# Altium project zs-pentagon-dip.PrjPCB
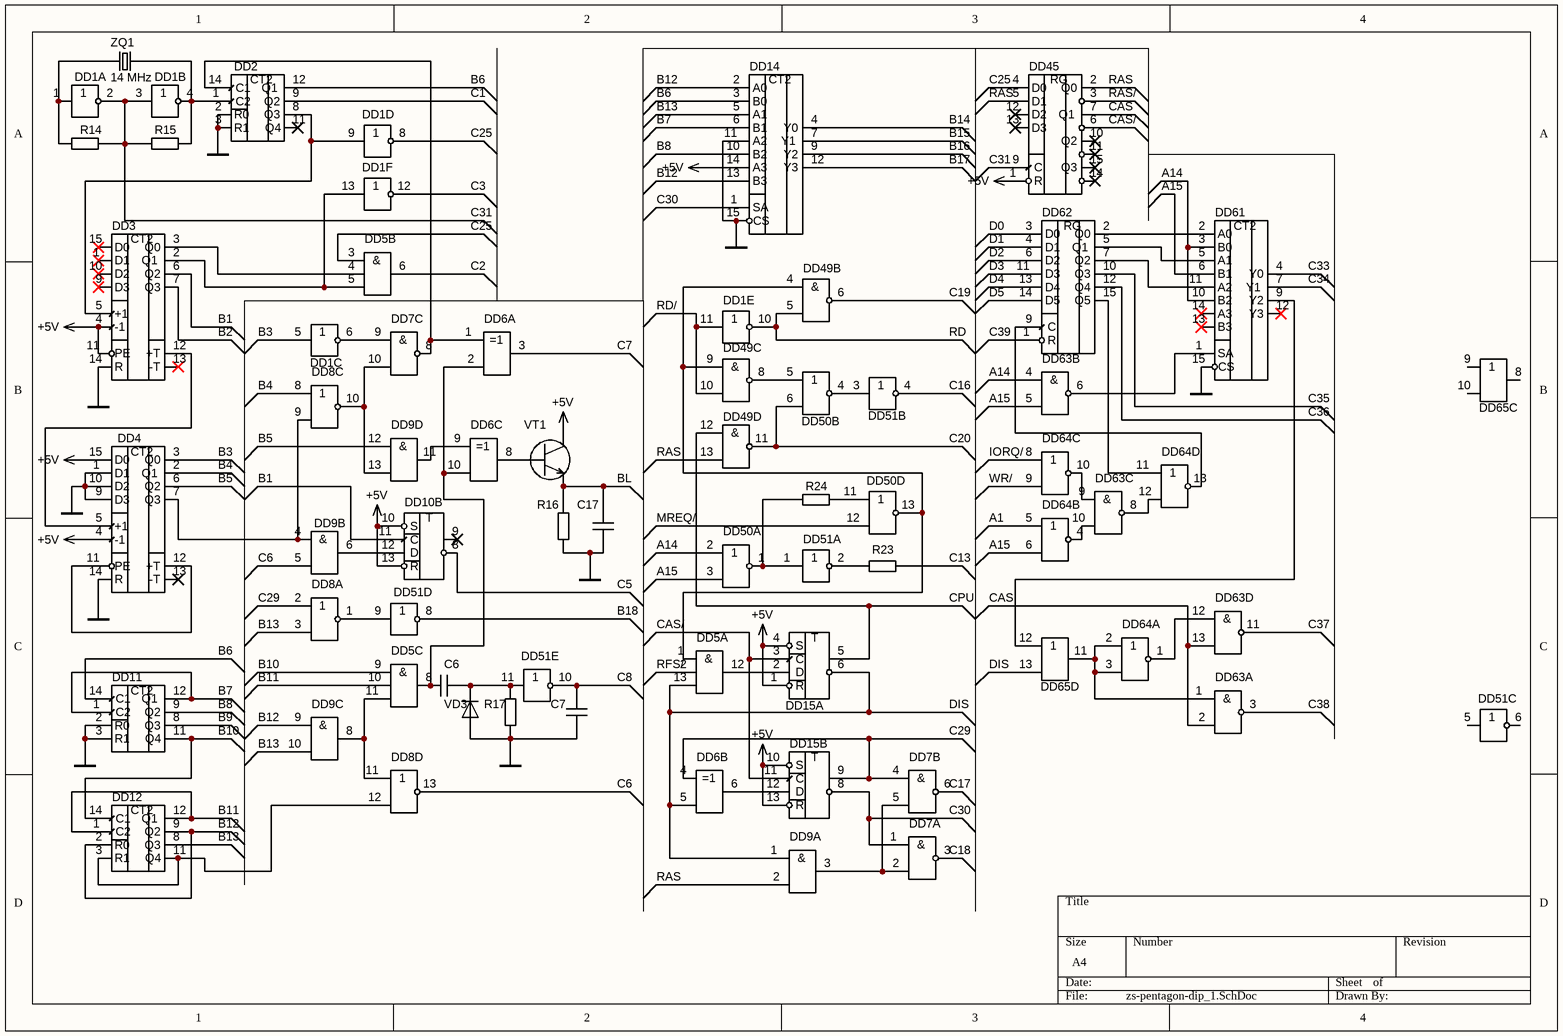
[diagram p0: zs-pentagon-dip_1.SchDoc]
5 sheets, 182 parts. Net scope: global (net labels, ports and power ports of the same name join across sheets).
Board file: zs-pentagon-dip.PcbDoc
Sheets:
  zs-pentagon-dip_1.SchDoc
  zs-pentagon-dip_2.SchDoc
  zs-pentagon-dip_3.SchDoc
  zs-pentagon-dip_4.SchDoc
  zs-pentagon-dip_5.SchDoc

## Sheet zs-pentagon-dip_1.SchDoc
size A4

### Parts
C6  0.022 мкФ  [C0805]  (value not drawn)
C7  510 пФ  [C0805]  (value not drawn)
C17  1200 пФ  [C0805]  (value not drawn)
DD1  КР1533ЛН1  [DIP14]  (value not drawn)  (parts A,B,C,D,E,F of 6)
DD2  КР1533ИЕ5  [DIP14]  (value not drawn)
DD3  КР1533ИЕ7  [DIP16]  (value not drawn)
DD4  КР1533ИЕ7  [DIP16]  (value not drawn)
DD5  КР1533ЛИ3  [DIP14]  (value not drawn)  (parts A,B,C of 3)
DD6  КР1533ЛП5  [DIP14]  (value not drawn)  (parts A,B,C of 4)
DD7  КР1533ЛA3  [DIP14]  (value not drawn)  (parts A,B,C of 4)
DD8  КР1533ЛЕ1  [DIP14]  (value not drawn)  (parts A,C,D of 4)
DD9  КР1533ЛИ1  [DIP14]  (value not drawn)  (parts A,B,C,D of 4)
DD10  КР1533ТМ2  [DIP14]  (value not drawn)  (part B of 2)
DD11  КР1533ИЕ5  [DIP14]  (value not drawn)
DD12  КР1533ИЕ5  [DIP14]  (value not drawn)
DD14  КР1533КП11А  [DIP16]  (value not drawn)
DD15  КР1533ТМ2  [DIP14]  (value not drawn)  (parts A,B of 2)
DD45  КР1533ТМ8  [DIP16]  (value not drawn)
DD49  КР1533ЛA3  [DIP14]  (value not drawn)  (parts B,C,D of 4)
DD50  КР1533ЛЕ1  [DIP14]  (value not drawn)  (parts A,B,D of 4)
DD51  КР1533ЛН1  [DIP14]  (value not drawn)  (parts A,B,C,D,E of 6)
DD61  КР1533КП11А  [DIP16]  (value not drawn)
DD62  КР1533ТМ9  [DIP16]  (value not drawn)
DD63  КР1533ЛA3  [DIP14]  (value not drawn)  (parts A,B,C,D of 4)
DD64  КР1533ЛЕ1  [DIP14]  (value not drawn)  (parts A,B,C,D of 4)
DD65  КР1533ЛЛ1  [DIP14]  (value not drawn)  (parts C,D of 4)
R14  510 Ом  [R0603]  (value not drawn)
R15  510 Ом  [R0603]  (value not drawn)
R16  160 Ом  [R0603]  (value not drawn)
R17  1 кОм  [R0603]  (value not drawn)
R23  470 Ом  [R0603]  (value not drawn)
R24  470 Ом  [R0603]  (value not drawn)
VD3  1N4148W  [SODFL1608X70N]  (value not drawn)
VT1  КТ315Б  [KT-13]  (value not drawn)
ZQ1  14 MHz  [XTAL_HC-49U]

### Nets
GND: C7.2 C17.1 DD1.7(GND) DD2.2(R0) DD2.3(R1) DD2.10(GND) DD3.8(GND) DD3.14(R) DD4.1(D1) DD4.8(GND) DD4.9(D3) DD4.10(D2) DD4.14(R) DD5.7(GND) DD6.7(GND) DD7.7(GND) DD8.7(GND) DD9.7(GND) DD11.2(R0) DD11.3(R1) DD11.10(GND) DD12.10(GND) DD14.8(GND) DD14.11(A2) DD14.15(CS) DD15.7(GND) DD45.8(GND) DD50.7(GND) DD51.7(GND) DD61.8(GND) DD61.15(CS) DD62.8(GND) DD63.7(GND) DD64.7(GND) R16.1 R17.1 VD3.A
VCC: DD1.14(VCC) DD2.5(VCC) DD3.4(-1) DD3.11(PE) DD3.16(VCC) DD4.4(-1) DD4.15(D0) DD4.16(VCC) DD5.14(VCC) DD6.14(VCC) DD7.14(VCC) DD8.14(VCC) DD9.14(VCC) DD10.10(S) DD10.13(R) DD11.5(VCC) DD12.5(VCC) DD14.14(A3) DD14.16(VCC) DD15.1(R) DD15.4(S) DD15.10(S) DD15.13(R) DD15.14(VCC) DD45.1(R) DD45.16(VCC) DD50.14(VCC) DD51.14(VCC) DD61.16(VCC) DD62.16(VCC) DD63.14(VCC) DD64.14(VCC) VT1.2(C)  [also labelled +5V]
A1: DD64.5
A14: DD50.2 DD61.3(B0) DD61.10(B2) DD63.4
A15: DD50.3 DD61.6(B1) DD63.5 DD64.6
B1: DD3.6(Q2) DD10.11(C)
B2: DD3.7(Q3)
B3: DD1.5 DD4.3(Q0)
B4: DD4.2(Q1) DD8.8
B5: DD4.6(Q2) DD9.12
B6: DD2.12(Q1) DD11.14(C1) DD14.3(B0)
B7: DD11.1(C2) DD11.12(Q1) DD14.6(B1)
B8: DD11.9(Q2) DD14.10(B2)
B9: DD11.8(Q3)
B10: DD5.9 DD11.11(Q4) DD12.14(C1)
B11: DD5.10 DD12.1(C2) DD12.12(Q1)
B12: DD9.9 DD12.2(R0) DD12.9(Q2) DD14.2(A0) DD14.13(B3)
B13: DD8.3 DD9.10 DD12.8(Q3) DD14.5(A1)
B14: DD14.4(Y0)
B15: DD14.7(Y1)
B16: DD14.9(Y2)
B17: DD14.12(Y3)
B18: DD51.8
BL: C17.2 R16.2 VT1.1(E)
C1: DD2.9(Q2)
C2: DD5.6
C3: DD1.12
C5: DD10.8
C6: DD8.13 DD9.5
C7: DD6.3
C8: C7.1 DD51.10
C13: R23.1
C16: DD51.4
C17: DD7.6
C18: DD7.3
C19: DD49.6
C20: DD49.11 DD50.6
C25: DD1.8 DD5.3 DD45.4(D0)
C29: DD6.4 DD7.4 DD8.2 DD15.9
C30: DD7.1 DD14.1(SA) DD15.8
C31: DD1.2 DD1.3 DD45.9(C) R14.2 R15.1
C33: DD61.4(Y0)
C34: DD61.7(Y1)
C35: DD62.10(Q3)
C36: DD62.12(Q4)
C37: DD63.11
C38: DD63.3
C39: DD62.1(R)
CAS: DD45.7(Q1) DD63.2 DD63.13
CAS/: DD15.3(C) DD15.11(C) DD45.6
CPU: DD15.5 DD49.12
D0: DD62.3(D0)
D1: DD62.4(D1)
D2: DD62.6(D2)
D3: DD62.11(D3)
D4: DD62.13(D4)
D5: DD62.14(D5)
DIS: DD5.13 DD6.5 DD9.1 DD15.6 DD65.13
IORQ/: DD64.8
MREQ/: DD50.12
RAS: DD9.2 DD45.2(Q0) DD45.5(D1) DD49.13
RAS/: DD45.3
RD: DD1.10 DD49.5
RD/: DD1.11 DD49.10
RFS/: DD5.2
WR/: DD64.9
NetC6_1: C6.1 DD51.11 R17.2 VD3.C
NetC6_2: C6.2 DD5.8 DD6.2 DD6.10
NetDD1_1: DD1.1 R14.1 ZQ1.2
NetDD1_4: DD1.4 DD2.1(C2) R15.2 ZQ1.1
NetDD1_6: DD1.6 DD7.9
NetDD1_9: DD1.9 DD2.8(Q3) DD3.5(+1)
NetDD1_13: DD1.13 DD3.2(Q1) DD5.5
NetDD2_14: DD2.14(C1) DD6.1 DD7.8
NetDD3_3: DD3.3(Q0) DD5.4
NetDD3_12: DD3.12(+T) DD4.5(+1)
NetDD4_7: DD4.7(Q3) DD8.9 DD9.4
NetDD4_11: DD4.11(PE) DD4.12(+T)
NetDD5_1: DD5.1 DD49.4 DD49.9 DD50.13
NetDD5_11: DD5.11 DD8.11 DD9.8
NetDD5_12: DD5.12 DD15.2(D)
NetDD6_6: DD6.6 DD15.12(D)
NetDD6_8: DD6.8 VT1.3(B)
NetDD6_9: DD6.9 DD9.11
NetDD7_2: DD7.2 DD7.5 DD9.3
NetDD7_10: DD7.10 DD8.10 DD9.13
NetDD8_1: DD8.1 DD51.9
NetDD8_12: DD8.12 DD12.3(R1) DD12.11(Q4)
NetDD9_6: DD9.6 DD10.12(D)
NetDD49_8: DD49.8 DD50.5
NetDD50_1: DD50.1 DD51.1 R24.2
NetDD50_4: DD50.4 DD51.3
NetDD50_11: DD50.11 R24.1
NetDD51_2: DD51.2 R23.2
NetDD61_1: DD61.1(SA) DD63.6
NetDD61_2: DD61.2(A0) DD62.2(Q0)
NetDD61_5: DD61.5(A1) DD62.5(Q1)
NetDD61_9: DD61.9(Y2) DD65.12
NetDD61_11: DD61.11(A2) DD62.7(Q2)
NetDD62_9: DD62.9(C) DD64.13
NetDD62_15: DD62.15(Q5) DD64.11
NetDD63_1: DD63.1 DD64.2 DD64.3 DD65.11
NetDD63_8: DD63.8 DD64.12
NetDD63_9: DD63.9 DD64.10
NetDD63_10: DD63.10 DD64.4
NetDD63_12: DD63.12 DD64.1

Not connected (* = marked no-connect by the designer): DD2 11(Q4)*; DD3 1(D1)* 9(D3)* 10(D2)* 13(-T)* 15(D0)*; DD4 13(-T)*; DD10 9*; DD45 10(Q2)* 11* 12(D2)* 13(D3)* 14* 15(Q3)*; DD51 5 6; DD61 12(Y3)* 13(B3)* 14(A3)*; DD65 8 9 10

### Notes on the sheet
- (in symbol КР1533ИЕ5) CT2
- (in symbol КР1533ИЕ7) CT2
- (in symbol КР1533КП11А) CT2
- (in symbol КР1533ЛA3, part A) &
- (in symbol КР1533ЛA3, part B) &
- (in symbol КР1533ЛA3, part C) &
- (in symbol КР1533ЛA3, part D) &
- (in symbol КР1533ЛИ1, part A) &
- (in symbol КР1533ЛИ1, part B) &
- (in symbol КР1533ЛИ1, part C) &
- (in symbol КР1533ЛИ1, part D) &
- (in symbol КР1533ЛИ3, part A) &
- (in symbol КР1533ЛИ3, part B) &
- (in symbol КР1533ЛИ3, part C) &
- (in symbol КР1533ТМ2, part A) Т
- (in symbol КР1533ТМ2, part B) Т
- (in symbol КР1533ТМ8) RG
- (in symbol КР1533ТМ9) RG

### Library data of the parts
C6 C7 C17 = CapCer
R14-R17 R23 R24 = Res
VT1 = КТ315Б: NPN Transistor
ZQ1 = HC-49U_14M

## Sheet zs-pentagon-dip_2.SchDoc
size A4
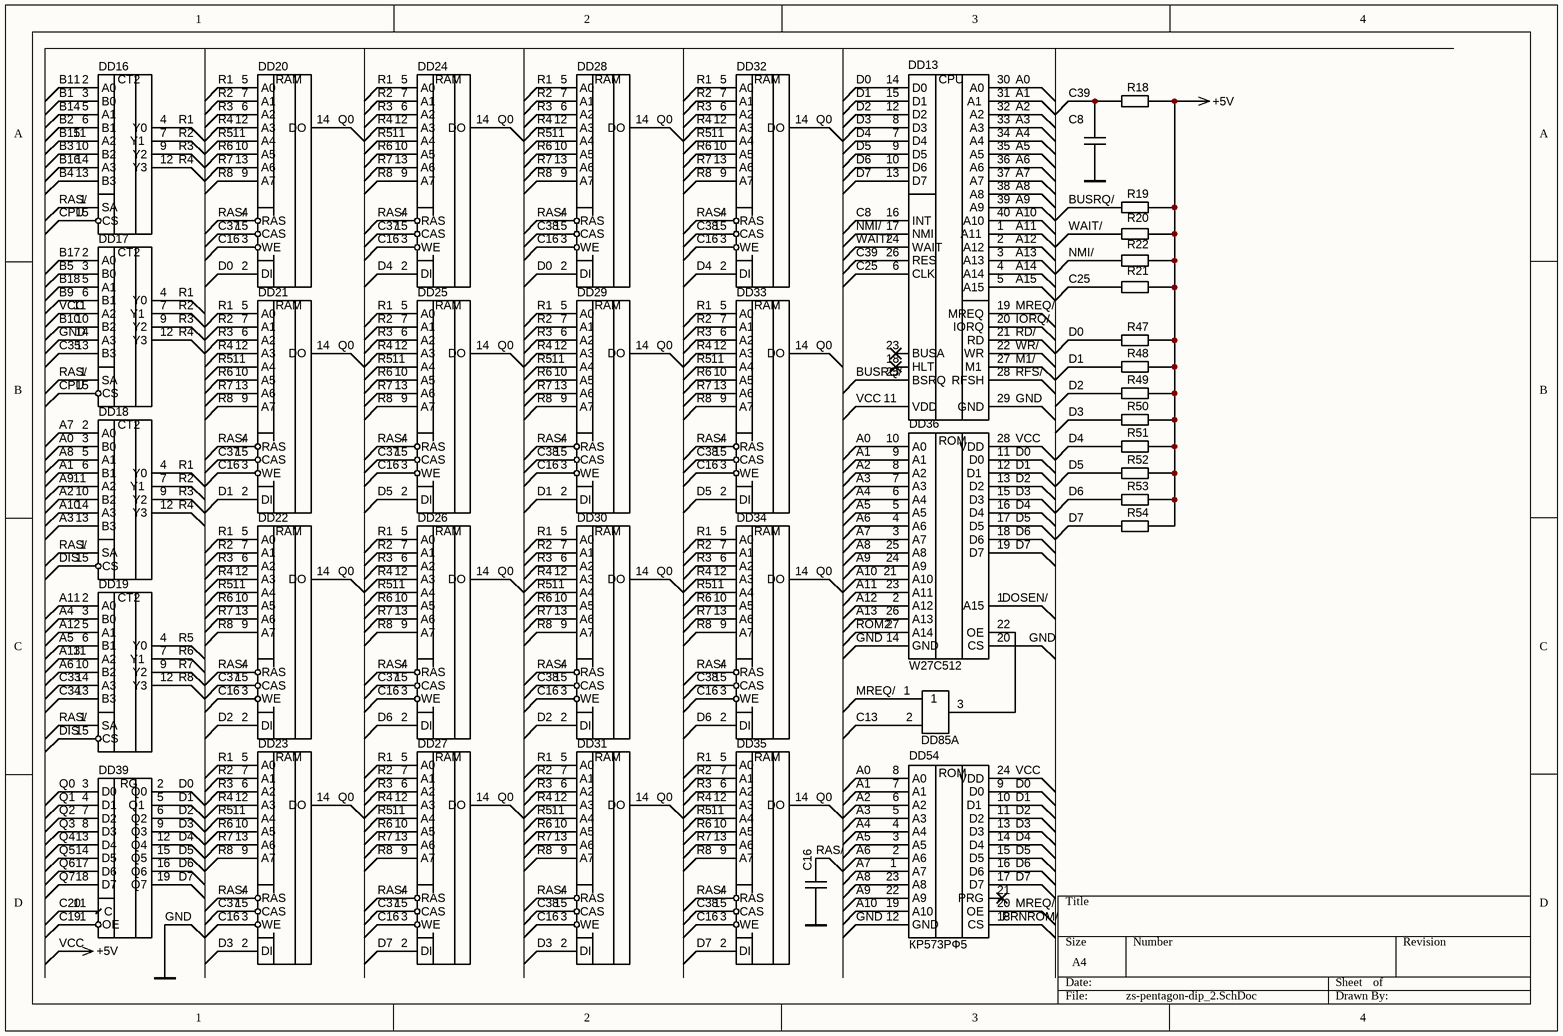
[diagram p1: zs-pentagon-dip_2.SchDoc]

### Parts
C8  10 мкФ  [C0805]  (value not drawn)
C16  51 пФ  [C0805]  (value not drawn)
DD13  Z80  [DIP1540W47P254L5320H635Q40B]  (value not drawn)
DD16  КР1533КП11А  [DIP16]  (value not drawn)
DD17  КР1533КП11А  [DIP16]  (value not drawn)
DD18  КР1533КП11А  [DIP16]  (value not drawn)
DD19  КР1533КП11А  [DIP16]  (value not drawn)
DD20  КР565РУ5Г  [DIP16]  (value not drawn)
DD21  КР565РУ5Г  [DIP16]  (value not drawn)
DD22  КР565РУ5Г  [DIP16]  (value not drawn)
DD23  КР565РУ5Г  [DIP16]  (value not drawn)
DD24  КР565РУ5Г  [DIP16]  (value not drawn)
DD25  КР565РУ5Г  [DIP16]  (value not drawn)
DD26  КР565РУ5Г  [DIP16]  (value not drawn)
DD27  КР565РУ5Г  [DIP16]  (value not drawn)
DD28  КР565РУ5Г  [DIP16]  (value not drawn)
DD29  КР565РУ5Г  [DIP16]  (value not drawn)
DD30  КР565РУ5Г  [DIP16]  (value not drawn)
DD31  КР565РУ5Г  [DIP16]  (value not drawn)
DD32  КР565РУ5Г  [DIP16]  (value not drawn)
DD33  КР565РУ5Г  [DIP16]  (value not drawn)
DD34  КР565РУ5Г  [DIP16]  (value not drawn)
DD35  КР565РУ5Г  [DIP16]  (value not drawn)
DD36  W27C512  [DIP28insocket]
DD39  КР1533ИР23  [DIP20]  (value not drawn)
DD54  КР573РФ5  [DIP24]
DD85  КР1533ЛЛ1  [DIP14]  (value not drawn)  (part A of 4)
R18  10 кОм  [R0603]  (value not drawn)  (no BOM)
R19  10 кОм  [R0603]  (value not drawn)  (no BOM)
R20  10 кОм  [R0603]  (value not drawn)  (no BOM)
R21  750 Ом  [R0603]  (value not drawn)  (no BOM)
R22  10 кОм  [R0603]  (value not drawn)  (no BOM)
R47  10 кОм  [R0603]  (value not drawn)  (no BOM)
R48  10 кОм  [R0603]  (value not drawn)  (no BOM)
R49  10 кОм  [R0603]  (value not drawn)  (no BOM)
R50  10 кОм  [R0603]  (value not drawn)  (no BOM)
R51  10 кОм  [R0603]  (value not drawn)  (no BOM)
R52  10 кОм  [R0603]  (value not drawn)  (no BOM)
R53  10 кОм  [R0603]  (value not drawn)  (no BOM)
R54  10 кОм  [R0603]  (value not drawn)  (no BOM)

### Nets
GND: C8.1 C16.1 DD13.29(GND) DD16.8(GND) DD17.8(GND) DD17.14(A3) DD18.8(GND) DD19.8(GND) DD36.14(GND) DD36.20(CS) DD39.10(GND) DD54.12(GND)
VCC: DD13.11(VDD) DD16.16(VCC) DD17.11(A2) DD17.16(VCC) DD18.16(VCC) DD19.16(VCC) DD36.28(VDD) DD39.20(VCC) DD54.24(VDD) R18.1 R19.1 R20.1 R21.1 R22.1 R47.1 R48.1 R49.1 R50.1 R51.1 R52.1 R53.1 R54.1  [also labelled +5V]
A0: DD13.30(A0) DD18.3(B0) DD36.10(A0) DD54.8(A0)
A1: DD13.31(A1) DD18.6(B1) DD36.9(A1) DD54.7(A1)
A2: DD13.32(A2) DD18.10(B2) DD36.8(A2) DD54.6(A2)
A3: DD13.33(A3) DD18.13(B3) DD36.7(A3) DD54.5(A3)
A4: DD13.34(A4) DD19.3(B0) DD36.6(A4) DD54.4(A4)
A5: DD13.35(A5) DD19.6(B1) DD36.5(A5) DD54.3(A5)
A6: DD13.36(A6) DD19.10(B2) DD36.4(A6) DD54.2(A6)
A7: DD13.37(A7) DD18.2(A0) DD36.3(A7) DD54.1(A7)
A8: DD13.38(A8) DD18.5(A1) DD36.25(A8) DD54.23(A8)
A9: DD13.39(A9) DD18.11(A2) DD36.24(A9) DD54.22(A9)
A10: DD13.40(A10) DD18.14(A3) DD36.21(A10) DD54.19(A10)
A11: DD13.1(A11) DD19.2(A0) DD36.23(A11)
A12: DD13.2(A12) DD19.5(A1) DD36.2(A12)
A13: DD13.3(A13) DD19.11(A2) DD36.26(A13)
A14: DD13.4(A14)
A15: DD13.5(A15)
B1: DD16.3(B0)
B2: DD16.6(B1)
B3: DD16.10(B2)
B4: DD16.13(B3)
B5: DD17.3(B0)
B9: DD17.6(B1)
B10: DD17.10(B2)
B11: DD16.2(A0)
B14: DD16.5(A1)
B15: DD16.11(A2)
B16: DD16.14(A3)
B17: DD17.2(A0)
B18: DD17.5(A1)
BUSRQ/: DD13.25(BSRQ) R19.2
C8: DD13.16(INT)
C13: DD85.2
C16: DD20.3(WE) DD21.3(WE) DD22.3(WE) DD23.3(WE) DD24.3(WE) DD25.3(WE) DD26.3(WE) DD27.3(WE) DD28.3(WE) DD29.3(WE) DD30.3(WE) DD31.3(WE) DD32.3(WE) DD33.3(WE) DD34.3(WE) DD35.3(WE)
C19: DD39.1(OE)
C20: DD39.11(C)
C25: DD13.6(CLK) R21.2
C33: DD19.14(A3)
C34: DD19.13(B3)
C35: DD17.13(B3)
C37: DD20.15(CAS) DD21.15(CAS) DD22.15(CAS) DD23.15(CAS) DD24.15(CAS) DD25.15(CAS) DD26.15(CAS) DD27.15(CAS)
C38: DD28.15(CAS) DD29.15(CAS) DD30.15(CAS) DD31.15(CAS) DD32.15(CAS) DD33.15(CAS) DD34.15(CAS) DD35.15(CAS)
C39: C8.2 DD13.26(RES) R18.2
CPU: DD16.15(CS) DD17.15(CS)
D0: DD13.14(D0) DD20.2(DI) DD28.2(DI) DD36.11(D0) DD39.2(Q0) DD54.9(D0) R47.2
D1: DD13.15(D1) DD21.2(DI) DD29.2(DI) DD36.12(D1) DD39.5(Q1) DD54.10(D1) R48.2
D2: DD13.12(D2) DD22.2(DI) DD30.2(DI) DD36.13(D2) DD39.6(Q2) DD54.11(D2) R49.2
D3: DD13.8(D3) DD23.2(DI) DD31.2(DI) DD36.15(D3) DD39.9(Q3) DD54.13(D3) R50.2
D4: DD13.7(D4) DD24.2(DI) DD32.2(DI) DD36.16(D4) DD39.12(Q4) DD54.14(D4) R51.2
D5: DD13.9(D5) DD25.2(DI) DD33.2(DI) DD36.17(D5) DD39.15(Q5) DD54.15(D5) R52.2
D6: DD13.10(D6) DD26.2(DI) DD34.2(DI) DD36.18(D6) DD39.16(Q6) DD54.16(D6) R53.2
D7: DD13.13(D7) DD27.2(DI) DD35.2(DI) DD36.19(D7) DD39.19(Q7) DD54.17(D7) R54.2
DIS: DD18.15(CS) DD19.15(CS)
DOSEN/: DD36.1(A15)
IORQ/: DD13.20(IORQ)
M1/: DD13.27(M1)
MREQ/: DD13.19(MREQ) DD54.20(OE) DD85.1
NMI/: DD13.17(NMI) R22.2
PRNROM/: DD54.18(CS)
Q0: DD20.14(DO) DD21.14(DO) DD22.14(DO) DD23.14(DO) DD24.14(DO) DD25.14(DO) DD26.14(DO) DD27.14(DO) DD28.14(DO) DD29.14(DO) DD30.14(DO) DD31.14(DO) DD32.14(DO) DD33.14(DO) DD34.14(DO) DD35.14(DO) DD39.3(D0)
Q1: DD39.4(D1)
Q2: DD39.7(D2)
Q3: DD39.8(D3)
Q4: DD39.13(D4)
Q5: DD39.14(D5)
Q6: DD39.17(D6)
Q7: DD39.18(D7)
R1: DD16.4(Y0) DD17.4(Y0) DD18.4(Y0) DD20.5(A0) DD21.5(A0) DD22.5(A0) DD23.5(A0) DD24.5(A0) DD25.5(A0) DD26.5(A0) DD27.5(A0) DD28.5(A0) DD29.5(A0) DD30.5(A0) DD31.5(A0) DD32.5(A0) DD33.5(A0) DD34.5(A0) DD35.5(A0)
R2: DD16.7(Y1) DD17.7(Y1) DD18.7(Y1) DD20.7(A1) DD21.7(A1) DD22.7(A1) DD23.7(A1) DD24.7(A1) DD25.7(A1) DD26.7(A1) DD27.7(A1) DD28.7(A1) DD29.7(A1) DD30.7(A1) DD31.7(A1) DD32.7(A1) DD33.7(A1) DD34.7(A1) DD35.7(A1)
R3: DD16.9(Y2) DD17.9(Y2) DD18.9(Y2) DD20.6(A2) DD21.6(A2) DD22.6(A2) DD23.6(A2) DD24.6(A2) DD25.6(A2) DD26.6(A2) DD27.6(A2) DD28.6(A2) DD29.6(A2) DD30.6(A2) DD31.6(A2) DD32.6(A2) DD33.6(A2) DD34.6(A2) DD35.6(A2)
R4: DD16.12(Y3) DD17.12(Y3) DD18.12(Y3) DD20.12(A3) DD21.12(A3) DD22.12(A3) DD23.12(A3) DD24.12(A3) DD25.12(A3) DD26.12(A3) DD27.12(A3) DD28.12(A3) DD29.12(A3) DD30.12(A3) DD31.12(A3) DD32.12(A3) DD33.12(A3) DD34.12(A3) DD35.12(A3)
R5: DD19.4(Y0) DD20.11(A4) DD21.11(A4) DD22.11(A4) DD23.11(A4) DD24.11(A4) DD25.11(A4) DD26.11(A4) DD27.11(A4) DD28.11(A4) DD29.11(A4) DD30.11(A4) DD31.11(A4) DD32.11(A4) DD33.11(A4) DD34.11(A4) DD35.11(A4)
R6: DD19.7(Y1) DD20.10(A5) DD21.10(A5) DD22.10(A5) DD23.10(A5) DD24.10(A5) DD25.10(A5) DD26.10(A5) DD27.10(A5) DD28.10(A5) DD29.10(A5) DD30.10(A5) DD31.10(A5) DD32.10(A5) DD33.10(A5) DD34.10(A5) DD35.10(A5)
R7: DD19.9(Y2) DD20.13(A6) DD21.13(A6) DD22.13(A6) DD23.13(A6) DD24.13(A6) DD25.13(A6) DD26.13(A6) DD27.13(A6) DD28.13(A6) DD29.13(A6) DD30.13(A6) DD31.13(A6) DD32.13(A6) DD33.13(A6) DD34.13(A6) DD35.13(A6)
R8: DD19.12(Y3) DD20.9(A7) DD21.9(A7) DD22.9(A7) DD23.9(A7) DD24.9(A7) DD25.9(A7) DD26.9(A7) DD27.9(A7) DD28.9(A7) DD29.9(A7) DD30.9(A7) DD31.9(A7) DD32.9(A7) DD33.9(A7) DD34.9(A7) DD35.9(A7)
RAS/: C16.2 DD16.1(SA) DD17.1(SA) DD18.1(SA) DD19.1(SA) DD20.4(RAS) DD21.4(RAS) DD22.4(RAS) DD23.4(RAS) DD24.4(RAS) DD25.4(RAS) DD26.4(RAS) DD27.4(RAS) DD28.4(RAS) DD29.4(RAS) DD30.4(RAS) DD31.4(RAS) DD32.4(RAS) DD33.4(RAS) DD34.4(RAS) DD35.4(RAS)
RD/: DD13.21(RD)
RFS/: DD13.28(RFSH)
ROM2: DD36.27(A14)
WAIT/: DD13.24(WAIT) R20.2
WR/: DD13.22(WR)
NetDD36_22: DD36.22(OE) DD85.3

Not connected (* = marked no-connect by the designer): DD13 18(HLT)* 23(BUSA)*; DD20 8(VCC) 16(GND); DD21 8(VCC) 16(GND); DD22 8(VCC) 16(GND); DD23 8(VCC) 16(GND); DD24 8(VCC) 16(GND); DD25 8(VCC) 16(GND); DD26 8(VCC) 16(GND); DD27 8(VCC) 16(GND); DD28 8(VCC) 16(GND); DD29 8(VCC) 16(GND); DD30 8(VCC) 16(GND); DD31 8(VCC) 16(GND); DD32 8(VCC) 16(GND); DD33 8(VCC) 16(GND); DD34 8(VCC) 16(GND); DD35 8(VCC) 16(GND); DD54 21(PRG)*; DD85 7(GND) 14(VCC)

### Notes on the sheet
- (in symbol W27C512) ROM
- (in symbol Z80) CPU
- (in symbol КР565РУ5Г) RAM
- (in symbol КР573РФ5) ROM
- (in symbol КР1533ИР23) RG
- (in symbol КР1533КП11А) CT2

### Library data of the parts
C8 C16 = CapCer
R18-R22 R47-R54 = Res

## Sheet zs-pentagon-dip_3.SchDoc
size A4
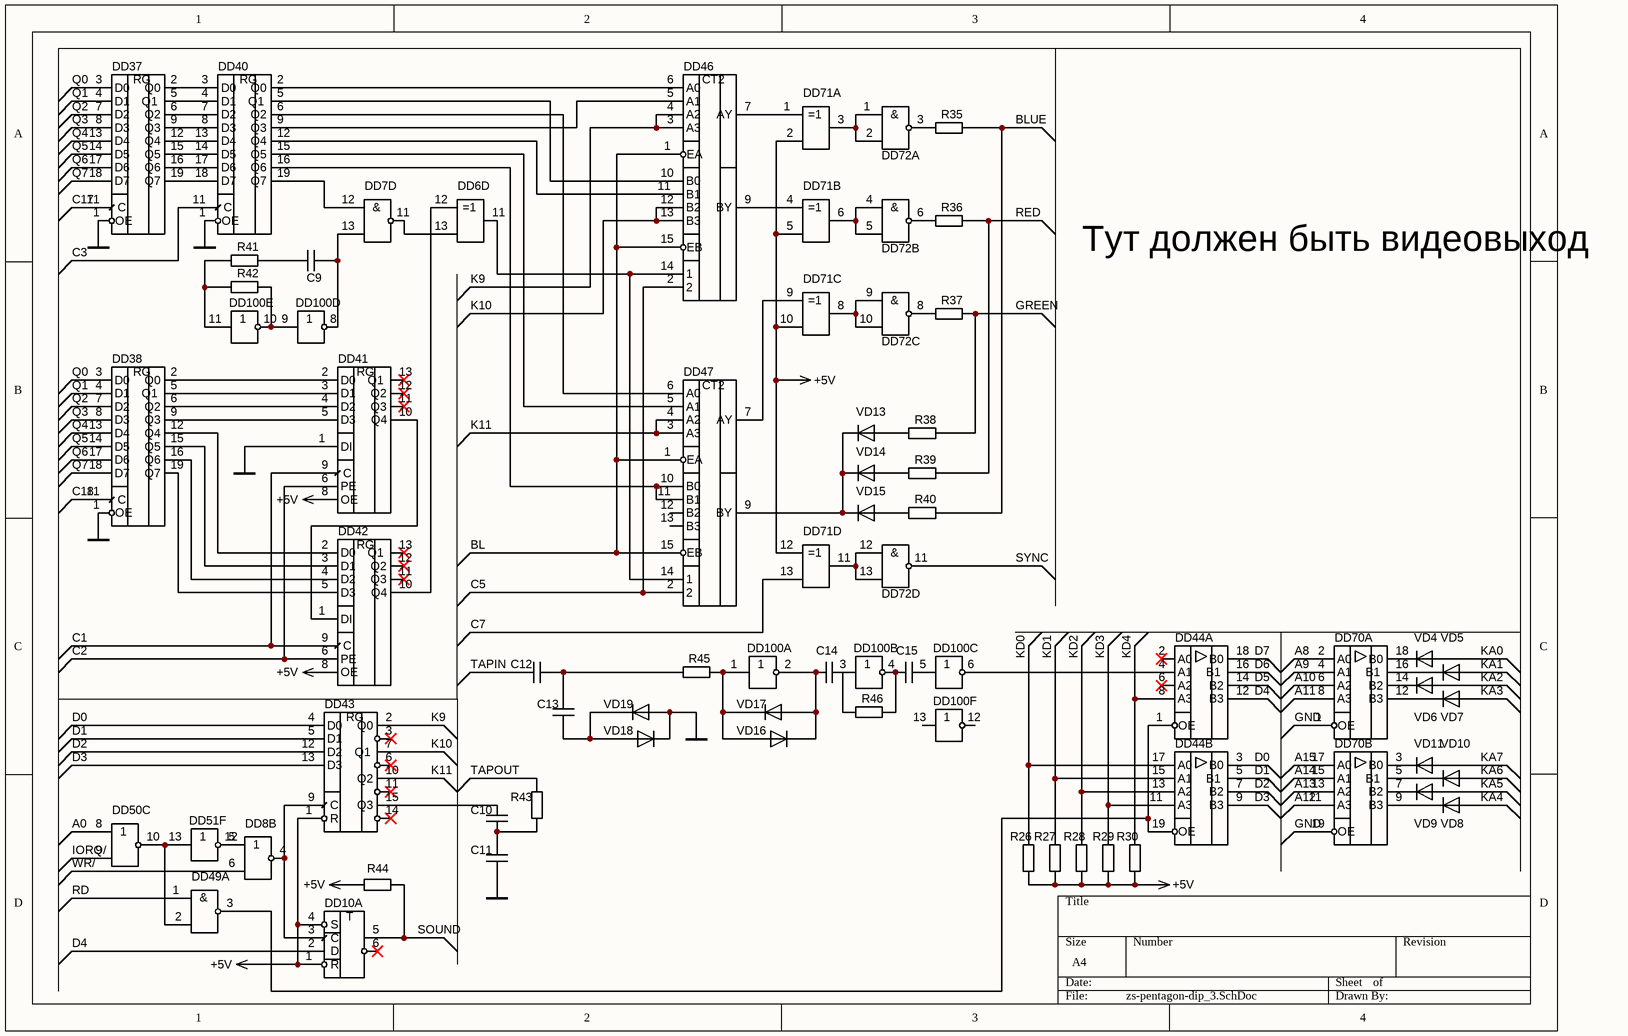
[diagram p2: zs-pentagon-dip_3.SchDoc]

### Parts
C9  0.47 мкФ  [C0805]  (value not drawn)
C10  0.22 мкФ  [C0805]  (value not drawn)
C11  0.1 мкФ  [C0805]  (value not drawn)
C12  1 мкФ  [C0805]  (value not drawn)
C13  10 мкФ  [C0805]  (value not drawn)
C14  1 мкФ  [C0805]  (value not drawn)
C15  1 мкФ  [C0805]  (value not drawn)
DD6  КР1533ЛП5  [DIP14]  (value not drawn)  (part D of 4)
DD7  КР1533ЛA3  [DIP14]  (value not drawn)  (part D of 4)
DD8  КР1533ЛЕ1  [DIP14]  (value not drawn)  (part B of 4)
DD10  КР1533ТМ2  [DIP14]  (value not drawn)  (part A of 2)
DD37  КР1533ИР23  [DIP20]  (value not drawn)
DD38  КР1533ИР23  [DIP20]  (value not drawn)
DD40  КР1533ИР23  [DIP20]  (value not drawn)
DD41  К555ИР16  [DIP14]  (value not drawn)
DD42  К555ИР16  [DIP14]  (value not drawn)
DD43  КР1533ТМ8  [DIP16]  (value not drawn)
DD44  КР1533АП5  [DIP20]  (value not drawn)  (parts A,B of 2)
DD46  КР1533КП2  [DIP16]  (value not drawn)
DD47  КР1533КП2  [DIP16]  (value not drawn)
DD49  КР1533ЛA3  [DIP14]  (value not drawn)  (part A of 4)
DD50  КР1533ЛЕ1  [DIP14]  (value not drawn)  (part C of 4)
DD51  КР1533ЛН1  [DIP14]  (value not drawn)  (part F of 6)
DD70  КР1533АП5  [DIP20]  (value not drawn)  (parts A,B of 2)
DD71  КР1533ЛП5  [DIP14]  (value not drawn)  (parts A,B,C,D of 4)
DD72  К155ЛA12  [DIP14]  (value not drawn)  (parts A,B,C,D of 4)
DD100  К561ЛН2  [DIP14]  (value not drawn)  (parts A,B,C,D,E,F of 6)
R26  10 кОм  [R0603]  (value not drawn)  (no BOM)
R27  10 кОм  [R0603]  (value not drawn)  (no BOM)
R28  10 кОм  [R0603]  (value not drawn)  (no BOM)
R29  10 кОм  [R0603]  (value not drawn)  (no BOM)
R30  10 кОм  [R0603]  (value not drawn)  (no BOM)
R35  68 Ом  [R0603]  (value not drawn)  (no BOM)
R36  68 Ом  [R0603]  (value not drawn)  (no BOM)
R37  68 Ом  [R0603]  (value not drawn)  (no BOM)
R38  68 Ом  [R0603]  (value not drawn)  (no BOM)
R39  68 Ом  [R0603]  (value not drawn)  (no BOM)
R40  68 Ом  [R0603]  (value not drawn)  (no BOM)
R41  1 МОм  [R0603]  (value not drawn)  (no BOM)
R42  1 МОм  [R0603]  (value not drawn)  (no BOM)
R43  10 кОм  [R0603]  (value not drawn)  (no BOM)
R44  430 Ом  [R0603]  (value not drawn)  (no BOM)
R45  620 Ом  [R0603]  (value not drawn)  (no BOM)
R46  100 кОм  [R0603]  (value not drawn)  (no BOM)
VD4  1N4148W  [SODFL1608X70N]  (value not drawn)
VD5  1N4148W  [SODFL1608X70N]  (value not drawn)
VD6  1N4148W  [SODFL1608X70N]  (value not drawn)
VD7  1N4148W  [SODFL1608X70N]  (value not drawn)
VD8  1N4148W  [SODFL1608X70N]  (value not drawn)
VD9  1N4148W  [SODFL1608X70N]  (value not drawn)
VD10  1N4148W  [SODFL1608X70N]  (value not drawn)
VD11  1N4148W  [SODFL1608X70N]  (value not drawn)
VD13  1N4148W  [SODFL1608X70N]  (value not drawn)
VD14  1N4148W  [SODFL1608X70N]  (value not drawn)
VD15  1N4148W  [SODFL1608X70N]  (value not drawn)
VD16  1N4148W  [SODFL1608X70N]  (value not drawn)
VD17  1N4148W  [SODFL1608X70N]  (value not drawn)
VD18  1N4148W  [SODFL1608X70N]  (value not drawn)
VD19  1N4148W  [SODFL1608X70N]  (value not drawn)

### Nets
GND: C11.2 DD10.7(GND) DD37.1(OE) DD37.10(GND) DD38.1(OE) DD38.10(GND) DD40.1(OE) DD40.10(GND) DD41.1(DI) DD41.7(GND) DD42.7(GND) DD43.8(GND) DD44.10(GND) DD46.8(GND) DD47.8(GND) DD49.7(GND) DD70.1(OE) DD70.10(GND) DD70.19(OE) DD71.7(GND) DD72.7(GND) DD100.7(GND) VD18.C VD19.A
VCC: DD10.1(R) DD10.4(S) DD10.14(VCC) DD37.20(VCC) DD38.20(VCC) DD40.20(VCC) DD41.8(OE) DD41.14(VCC) DD42.8(OE) DD42.14(VCC) DD43.1(R) DD43.16(VCC) DD44.20(VCC) DD46.16(VCC) DD47.16(VCC) DD49.14(VCC) DD70.20(VCC) DD71.2 DD71.5 DD71.10 DD71.12 DD71.14(VCC) DD72.14(VCC) DD100.14(VCC) R26.2 R27.2 R28.2 R29.2 R30.2 R44.1  [also labelled +5V]
A0: DD50.8
A8: DD70.2(A0)
A9: DD70.4(A1)
A10: DD70.6(A2)
A11: DD70.8(A3)
A12: DD70.11(A3)
A13: DD70.13(A2)
A14: DD70.15(A1)
A15: DD70.17(A0)
BL: DD46.1(EA) DD46.15(EB) DD47.1(EA) DD47.15(EB)
BLUE: R35.1 R40.1
C1: DD41.9(C) DD42.9(C)
C2: DD41.6(PE) DD42.6(PE)
C3: DD40.11(C)
C5: DD46.2 DD47.2
C7: DD71.13
C17: DD37.11(C)
C18: DD38.11(C)
D0: DD43.4(D0) DD44.3(B0)
D1: DD43.5(D1) DD44.5(B1)
D2: DD43.12(D2) DD44.7(B2)
D3: DD43.13(D3) DD44.9(B3)
D4: DD10.2(D) DD44.12(B3)
D5: DD44.14(B2)
D6: DD44.16(B1)
D7: DD44.18(B0)
GREEN: R37.1 R38.1
IORQ/: DD50.9
K9: DD43.2(Q0) DD46.3(A3) DD46.4(A2)
K10: DD43.7(Q1) DD46.12(B2) DD46.13(B3)
K11: DD43.10(Q2) DD47.3(A3) DD47.4(A2)
KA0: VD4.A
KA1: VD5.A
KA2: VD6.A
KA3: VD7.A
KA4: VD8.A
KA5: VD9.A
KA6: VD10.A
KA7: VD11.A
KD0: DD44.17(A0) R26.1
KD1: DD44.15(A1) R27.1
KD2: DD44.13(A2) R28.1
KD3: DD44.11(A3) R29.1
KD4: DD44.8(A3) R30.1
Q0: DD37.3(D0) DD38.3(D0)
Q1: DD37.4(D1) DD38.4(D1)
Q2: DD37.7(D2) DD38.7(D2)
Q3: DD37.8(D3) DD38.8(D3)
Q4: DD37.13(D4) DD38.13(D4)
Q5: DD37.14(D5) DD38.14(D5)
Q6: DD37.17(D6) DD38.17(D6)
Q7: DD37.18(D7) DD38.18(D7)
RD: DD49.1
RED: R36.1 R39.1
SOUND: DD10.5 R44.2
SYNC: DD72.11
TAPIN: C12.1
TAPOUT: R43.1
WR/: DD8.6
NetC9_1: C9.1 DD7.13 DD100.8
NetC9_2: C9.2 R41.1
NetC10_1: C10.1 DD43.15(Q3)
NetC10_2: C10.2 C11.1 R43.2
NetC12_2: C12.2 C13.2 R45.2
NetC13_1: C13.1 VD18.A VD19.C
NetC14_1: C14.1 DD100.2 VD16.C VD17.A
NetC14_2: C14.2 DD100.3 R46.2
NetC15_1: C15.1 DD100.4 R46.1
NetC15_2: C15.2 DD100.5
NetDD6_11: DD6.11 DD46.14(1) DD47.14(1)
NetDD6_12: DD6.12 DD42.10(Q4)
NetDD6_13: DD6.13 DD7.11
NetDD7_12: DD7.12 DD40.19(Q7)
NetDD8_4: DD8.4 DD10.3(C) DD43.9(C)
NetDD8_5: DD8.5 DD51.12
NetDD37_2: DD37.2(Q0) DD40.3(D0)
NetDD37_5: DD37.5(Q1) DD40.4(D1)
NetDD37_6: DD37.6(Q2) DD40.7(D2)
NetDD37_9: DD37.9(Q3) DD40.8(D3)
NetDD37_12: DD37.12(Q4) DD40.13(D4)
NetDD37_15: DD37.15(Q5) DD40.14(D5)
NetDD37_16: DD37.16(Q6) DD40.17(D6)
NetDD37_19: DD37.19(Q7) DD40.18(D7)
NetDD38_2: DD38.2(Q0) DD41.2(D0)
NetDD38_5: DD38.5(Q1) DD41.3(D1)
NetDD38_6: DD38.6(Q2) DD41.4(D2)
NetDD38_9: DD38.9(Q3) DD41.5(D3)
NetDD38_12: DD38.12(Q4) DD42.2(D0)
NetDD38_15: DD38.15(Q5) DD42.3(D1)
NetDD38_16: DD38.16(Q6) DD42.4(D2)
NetDD38_19: DD38.19(Q7) DD42.5(D3)
NetDD40_2: DD40.2(Q0) DD46.6(A0)
NetDD40_5: DD40.5(Q1) DD46.10(B0)
NetDD40_6: DD40.6(Q2) DD47.6(A0)
NetDD40_9: DD40.9(Q3) DD46.5(A1)
NetDD40_12: DD40.12(Q4) DD46.11(B1)
NetDD40_15: DD40.15(Q5) DD47.5(A1)
NetDD40_16: DD40.16(Q6) DD47.10(B0) DD47.11(B1)
NetDD41_10: DD41.10(Q4) DD42.1(DI)
NetDD44_1: DD44.1(OE) DD44.19(OE) DD49.3
NetDD44_4: DD44.4(A1) DD100.6
NetDD46_7: DD46.7(AY) DD71.1
NetDD46_9: DD46.9(BY) DD71.4
NetDD47_7: DD47.7(AY) DD71.9
NetDD47_9: DD47.9(BY) VD13.C VD14.C VD15.C
NetDD49_2: DD49.2 DD50.10 DD51.13
NetDD70_3: DD70.3(B0) VD11.C
NetDD70_5: DD70.5(B1) VD10.C
NetDD70_7: DD70.7(B2) VD9.C
NetDD70_9: DD70.9(B3) VD8.C
NetDD70_12: DD70.12(B3) VD7.C
NetDD70_14: DD70.14(B2) VD6.C
NetDD70_16: DD70.16(B1) VD5.C
NetDD70_18: DD70.18(B0) VD4.C
NetDD71_3: DD71.3 DD72.1 DD72.2
NetDD71_6: DD71.6 DD72.4 DD72.5
NetDD71_8: DD71.8 DD72.9 DD72.10
NetDD71_11: DD71.11 DD72.12 DD72.13
NetDD72_3: DD72.3 R35.2
NetDD72_6: DD72.6 R36.2
NetDD72_8: DD72.8 R37.2
NetDD100_1: DD100.1 R45.1 VD16.A VD17.C
NetDD100_9: DD100.9 DD100.10 R42.1
NetDD100_11: DD100.11 R41.2 R42.2
NetR38_2: R38.2 VD13.A
NetR39_2: R39.2 VD14.A
NetR40_2: R40.2 VD15.A

Not connected (* = marked no-connect by the designer): DD10 6*; DD41 11(Q3)* 12(Q2)* 13(Q1)*; DD42 11(Q3)* 12(Q2)* 13(Q1)*; DD43 3* 6* 11* 14*; DD44 2(A0)* 6(A2)*; DD47 12(B2) 13(B3); DD100 12 13

### Notes on the sheet
- Тут должен быть видеовыход
- (in symbol К155ЛA12, part A) &
- (in symbol К155ЛA12, part B) &
- (in symbol К155ЛA12, part C) &
- (in symbol К155ЛA12, part D) &
- (in symbol К555ИР16) RG
- (in symbol КР1533ИР23) RG
- (in symbol КР1533КП2) CT2
- (in symbol КР1533ЛA3, part A) &
- (in symbol КР1533ЛA3, part D) &
- (in symbol КР1533ТМ2, part A) Т
- (in symbol КР1533ТМ8) RG

### Library data of the parts
C9-C15 = CapCer
R26-R30 R35-R46 = Res

## Sheet zs-pentagon-dip_4.SchDoc
size A4
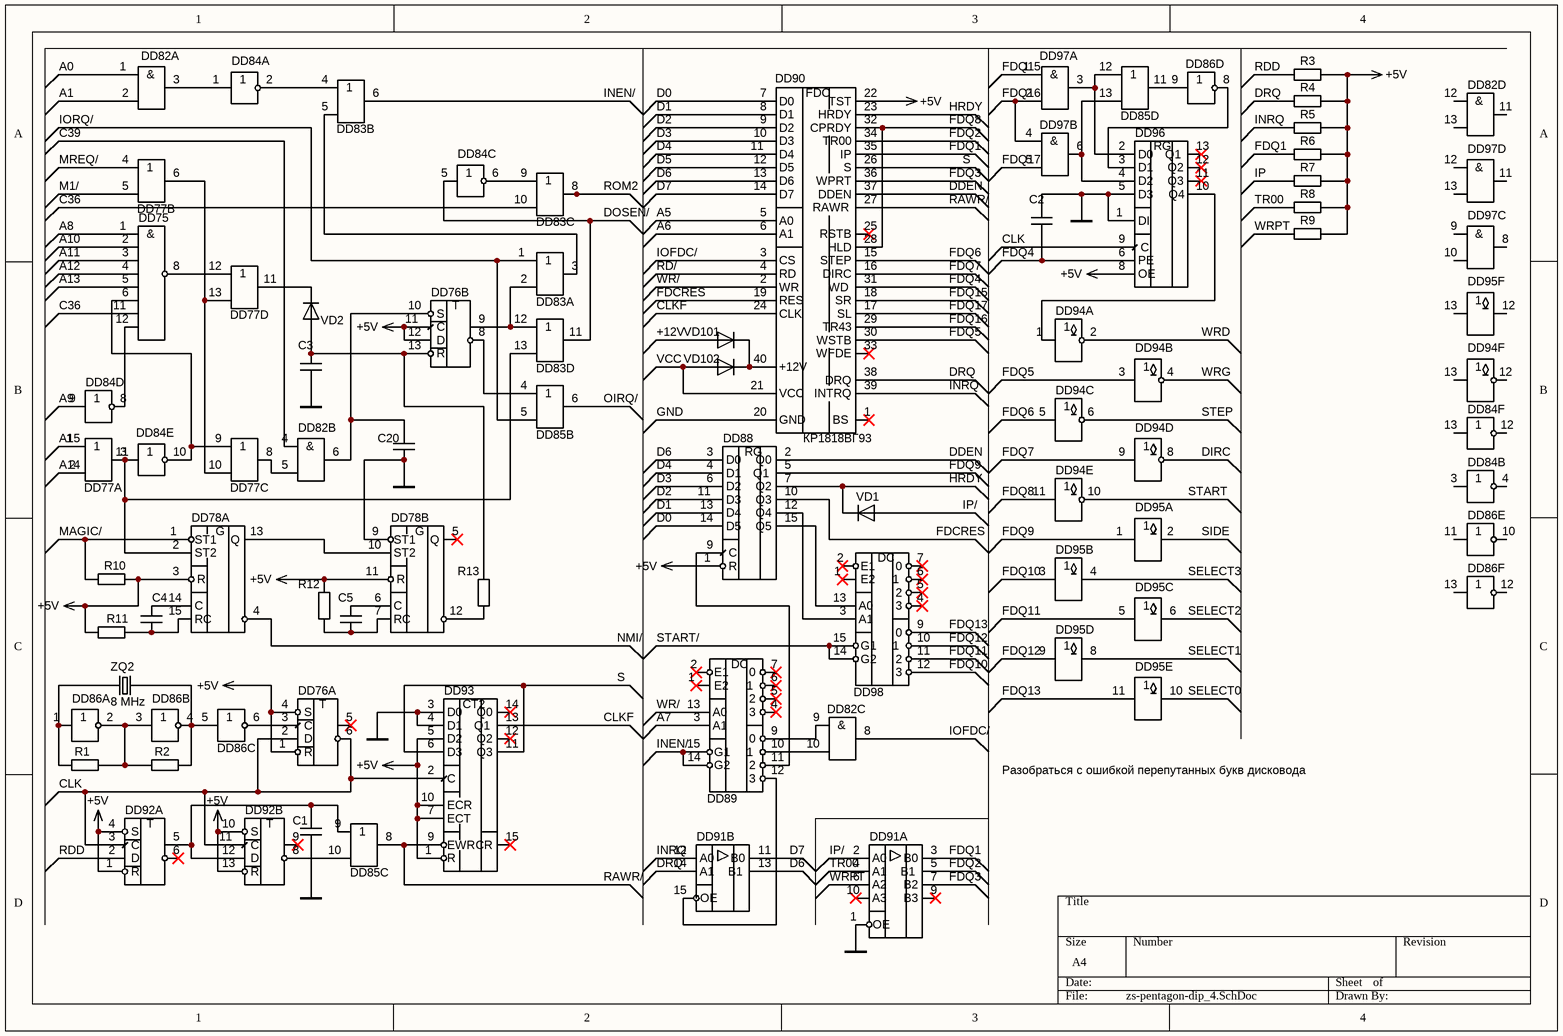
[diagram p3: zs-pentagon-dip_4.SchDoc]

### Parts
C1  220 пФ  [C0805]  (value not drawn)
C2  100 пФ  [C0805]  (value not drawn)
C3  200 пФ  [C0805]  (value not drawn)
C4  1 мкФ  [C0805]  (value not drawn)
C5  750 пФ  [C0805]  (value not drawn)
C20  270 пФ  [C0805]  (value not drawn)
DD75  КР1533ЛA2  [DIP14]  (value not drawn)
DD76  КР1533ТМ2  [DIP14]  (value not drawn)  (parts A,B of 2)
DD77  КР1533ЛЛ1  [DIP14]  (value not drawn)  (parts A,B,C,D of 4)
DD78  КР1533АГ3  [DIP16]  (value not drawn)  (parts A,B of 2)
DD82  КР1533ЛИ1  [DIP14]  (value not drawn)  (parts A,B,C,D of 4)
DD83  КР1533ЛЛ1  [DIP14]  (value not drawn)  (parts A,B,C,D of 4)
DD84  КР1533ЛН1  [DIP14]  (value not drawn)  (parts A,B,C,D,E,F of 6)
DD85  КР1533ЛЛ1  [DIP14]  (value not drawn)  (parts B,C,D of 4)
DD86  КР1533ЛН1  [DIP14]  (value not drawn)  (parts A,B,C,D,E,F of 6)
DD88  КР1533ТМ9  [DIP16]  (value not drawn)
DD89  КР1533ИД4  [DIP16]  (value not drawn)
DD90  КР1818ВГ93  [KR1818VG93]
DD91  КР1533ЛП11  [DIP16]  (value not drawn)  (parts A,B of 2)
DD92  КР1533ТМ2  [DIP14]  (value not drawn)  (parts A,B of 2)
DD93  КР1533ИЕ10  [DIP16]  (value not drawn)
DD94  КР1533ЛН2  [DIP14]  (value not drawn)  (parts A,B,C,D,E,F of 6)
DD95  К155ЛП9  [DIP14]  (value not drawn)  (parts A,B,C,D,E,F of 6)
DD96  К555ИР16  [DIP14]  (value not drawn)
DD97  КР1533ЛИ1  [DIP14]  (value not drawn)  (parts A,B,C,D of 4)
DD98  КР1533ИД4  [DIP16]  (value not drawn)
R1  510 Ом  [R0603]  (value not drawn)  (no BOM)
R2  510 Ом  [R0603]  (value not drawn)  (no BOM)
R3  10 кОм  [R0603]  (value not drawn)  (no BOM)
R4  10 кОм  [R0603]  (value not drawn)  (no BOM)
R5  10 кОм  [R0603]  (value not drawn)  (no BOM)
R6  10 кОм  [R0603]  (value not drawn)  (no BOM)
R7  1 кОм  [R0603]  (value not drawn)  (no BOM)
R8  1 кОм  [R0603]  (value not drawn)  (no BOM)
R9  1 кОм  [R0603]  (value not drawn)  (no BOM)
R10  1 кОм  [R0603]  (value not drawn)  (no BOM)
R11  1 кОм  [R0603]  (value not drawn)  (no BOM)
R12  18 кОм  [R0603]  (value not drawn)  (no BOM)
R13  470 Ом  [R0603]  (value not drawn)  (no BOM)
VD1  1N4148W  [SODFL1608X70N]  (value not drawn)
VD2  1N4148W  [SODFL1608X70N]  (value not drawn)
VD101  1N4148W  [SODFL1608X70N]  (value not drawn)
VD102  1N4148W  [SODFL1608X70N]  (value not drawn)
ZQ2  8 MHz  [XTAL_HC-49U]

### Nets
+12V: VD101.A
GND: C1.1 C2.2 C3.1 C20.1 DD75.7(GND) DD76.7(GND) DD78.8(GND) DD78.9(ST1) DD82.7(GND) DD84.7(GND) DD86.7(GND) DD88.8(GND) DD90.20(GND) DD91.1(OE) DD91.8(GND) DD92.7(GND) DD93.3(D0) DD93.4(D1) DD93.8(GND) DD94.7(GND) DD95.7(GND) DD96.1(DI) DD96.5(D3) DD96.7(GND) DD97.7(GND)
VCC: DD75.14(VCC) DD76.1(R) DD76.4(S) DD76.11(C) DD76.12(D) DD76.14(VCC) DD78.3(R) DD78.11(R) DD78.16(VCC) DD82.14(VCC) DD84.14(VCC) DD86.14(VCC) DD88.1(R) DD88.16(VCC) DD90.21(VCC) DD90.22(TST) DD91.16(VCC) DD92.1(R) DD92.4(S) DD92.10(S) DD92.13(R) DD92.14(VCC) DD93.1(R) DD93.5(D2) DD93.7(ECT) DD93.10(ECR) DD93.16(VCC) DD94.14(VCC) DD95.14(VCC) DD96.8(OE) DD96.14(VCC) DD97.14(VCC) R3.1 R4.1 R5.1 R6.1 R7.1 R8.1 R9.1 R10.1 R11.2 R12.2 VD102.A  [also labelled +5V]
A0: DD82.1
A1: DD82.2
A5: DD90.5(A0)
A6: DD90.6(A1)
A7: DD89.3(A1)
A8: DD75.1
A9: DD84.9
A10: DD75.2
A11: DD75.3
A12: DD75.4
A13: DD75.5
A14: DD77.2
A15: DD77.1
C36: DD75.11 DD83.10
C39: DD82.4
CLK: DD76.2(D) DD76.6 DD92.3(C) DD92.11(C) DD93.2(C) DD96.9(C)
CLKF: DD90.24(CLK) DD93.13(Q1)
D0: DD88.14(D5) DD90.7(D0)
D1: DD88.13(D4) DD90.8(D1)
D2: DD88.11(D3) DD90.9(D2)
D3: DD88.6(D2) DD90.10(D3)
D4: DD88.4(D1) DD90.11(D4)
D5: DD90.12(D5)
D6: DD88.3(D0) DD90.13(D6) DD91.13(B1)
D7: DD90.14(D7) DD91.11(B0)
DDEN: DD88.2(Q0) DD90.37(DDEN)
DIRC: DD94.8
DOSEN/: DD83.11 DD84.5
DRQ: DD90.38(DRQ) DD91.14(A1) R4.2
FDCRES: DD88.10(Q3) DD90.19(RES)
FDQ1: DD90.35(IP) DD91.3(B0) R6.2
FDQ2: DD90.34(TR00) DD91.5(B1)
FDQ3: DD90.36(WPRT) DD91.7(B2)
FDQ4: C2.1 DD90.31(WD) DD96.6(PE)
FDQ5: DD90.30(WSTB) DD94.3
FDQ6: DD90.15(STEP) DD94.5
FDQ7: DD90.16(DIRC) DD94.9
FDQ8: DD90.28(HLD) DD90.32(CPRDY) DD94.11
FDQ9: DD88.5(Q1) DD95.1
FDQ10: DD95.3 DD98.12(3)
FDQ11: DD95.5 DD98.11(2)
FDQ12: DD95.9 DD98.10(1)
FDQ13: DD95.11 DD98.9(0)
FDQ15: DD90.18(SR) DD97.1
FDQ16: DD90.29(TR43) DD97.2 DD97.4
FDQ17: DD90.17(SL) DD97.5
HRDY: DD88.7(Q2) DD90.23(HRDY) VD1.C
INEN/: DD83.6 DD89.14(G2) DD89.15(G1)
INRQ: DD90.39(INTRQ) DD91.12(A0) R5.2
IOFDC/: DD82.8 DD90.3(CS)
IORQ/: DD83.1 DD85.5
IP: R7.2
IP/: DD91.2(A0) VD1.A
M1/: DD77.5
MAGIC/: DD78.1(ST1) R10.2
MREQ/: DD77.4
NMI/: DD78.4
OIRQ/: DD85.6
RAWR/: DD85.8 DD90.27(RAWR) DD93.9(EWR)
RD/: DD90.4(RD)
RDD: DD92.2(D) R3.2
ROM2: DD83.8
S: DD90.26(S) DD93.6(D3) DD93.11(Q3)
SELECT0: DD95.10
SELECT1: DD95.8
SELECT2: DD95.6
SELECT3: DD95.4
SIDE: DD95.2
START: DD94.10
START/: DD98.14(G2) DD98.15(G1)
STEP: DD94.6
TR00: DD91.4(A1) R8.2
WR/: DD89.13(A0) DD90.2(WR)
WRD: DD94.2
WRG: DD94.4
WRPT: DD91.6(A2) R9.2
NetC1_2: C1.2 DD85.9 DD92.5 DD92.12(D)
NetC3_2: C3.2 DD76.13(R) R13.2 VD2.A
NetC4_1: C4.1 DD78.15(RC) R11.1
NetC4_2: C4.2 DD78.14(C)
NetC5_1: C5.1 DD78.7(RC) R12.1
NetC5_2: C5.2 DD78.6(C)
NetC20_2: C20.2 DD76.10(S) DD82.6
NetDD75_6: DD75.6 DD77.9 DD84.10
NetDD75_8: DD75.8 DD77.12
NetDD75_12: DD75.12 DD84.8
NetDD76_3: DD76.3(C) DD86.6
NetDD76_8: DD76.8 DD85.4
NetDD76_9: DD76.9 DD83.2 DD83.12
NetDD77_3: DD77.3 DD78.2(ST2) DD83.13 DD84.11
NetDD77_6: DD77.6 DD77.10 DD77.13
NetDD77_8: DD77.8 DD82.5
NetDD77_11: DD77.11 VD2.C
NetDD78_10: DD78.10(ST2) DD78.13(Q)
NetDD78_12: DD78.12 R13.1
NetDD82_3: DD82.3 DD84.1
NetDD82_9: DD82.9 DD89.9(0)
NetDD82_10: DD82.10 DD89.10(1)
NetDD83_3: DD83.3 DD83.5
NetDD83_4: DD83.4 DD84.2
NetDD83_9: DD83.9 DD84.6
NetDD85_10: DD85.10 DD92.8
NetDD85_11: DD85.11 DD86.9
NetDD85_12: DD85.12 DD96.2(D0) DD97.3
NetDD85_13: DD85.13 DD96.4(D2) DD97.6
NetDD86_1: DD86.1 R1.2 ZQ2.1
NetDD86_2: DD86.2 DD86.3 R1.1 R2.2
NetDD86_4: DD86.4 DD86.5 R2.1 ZQ2.2
NetDD86_8: DD86.8 DD96.3(D1)
NetDD88_9: DD88.9(C) DD89.11(2)
NetDD88_12: DD88.12(Q4) DD98.3(A1)
NetDD88_15: DD88.15(Q5) DD98.13(A0)
NetDD89_12: DD89.12(3) DD91.15(OE)
NetDD90_40: DD90.40(+12V) VD101.C VD102.C
NetDD94_1: DD94.1 DD96.10(Q4)

Not connected (* = marked no-connect by the designer): DD76 5*; DD77 7(GND) 14(VCC); DD78 5(Q)*; DD82 11 12 13; DD83 7(GND) 14(VCC); DD84 3 4 12 13; DD86 10 11 12 13; DD89 1(E2)* 2(E1)* 4(3)* 5(2)* 6(1)* 7(0)* 8(GND) 16(VCC); DD90 1(BS)* 25(RSTB)* 33(WFDE)*; DD91 9(B3)* 10(A3)*; DD92 6* 9*; DD93 12(Q2)* 14(Q0)* 15(CR)*; DD94 12 13; DD95 12 13; DD96 11(Q3)* 12(Q2)* 13(Q1)*; DD97 8 9 10 11 12 13; DD98 1(E2)* 2(E1)* 4(3)* 5(2)* 6(1)* 7(0)* 8(GND) 16(VCC)

### Notes on the sheet
- Разобраться с ошибкой перепутанных букв дисковода
- (in symbol К555ИР16) RG
- (in symbol КР1533АГ3, part A) G
- (in symbol КР1533АГ3, part B) G
- (in symbol КР1533ИД4) DC
- (in symbol КР1533ИЕ10) CT2
- (in symbol КР1533ЛA2) &
- (in symbol КР1533ЛИ1, part A) &
- (in symbol КР1533ЛИ1, part B) &
- (in symbol КР1533ЛИ1, part C) &
- (in symbol КР1533ЛИ1, part D) &
- (in symbol КР1533ТМ2, part A) Т
- (in symbol КР1533ТМ2, part B) Т
- (in symbol КР1533ТМ9) RG
- (in symbol КР1818ВГ93) FDC

### Library data of the parts
C1-C5 C20 = CapCer
R1-R13 = Res
ZQ2 = HC-49U_8M

## Sheet zs-pentagon-dip_5.SchDoc
size A4
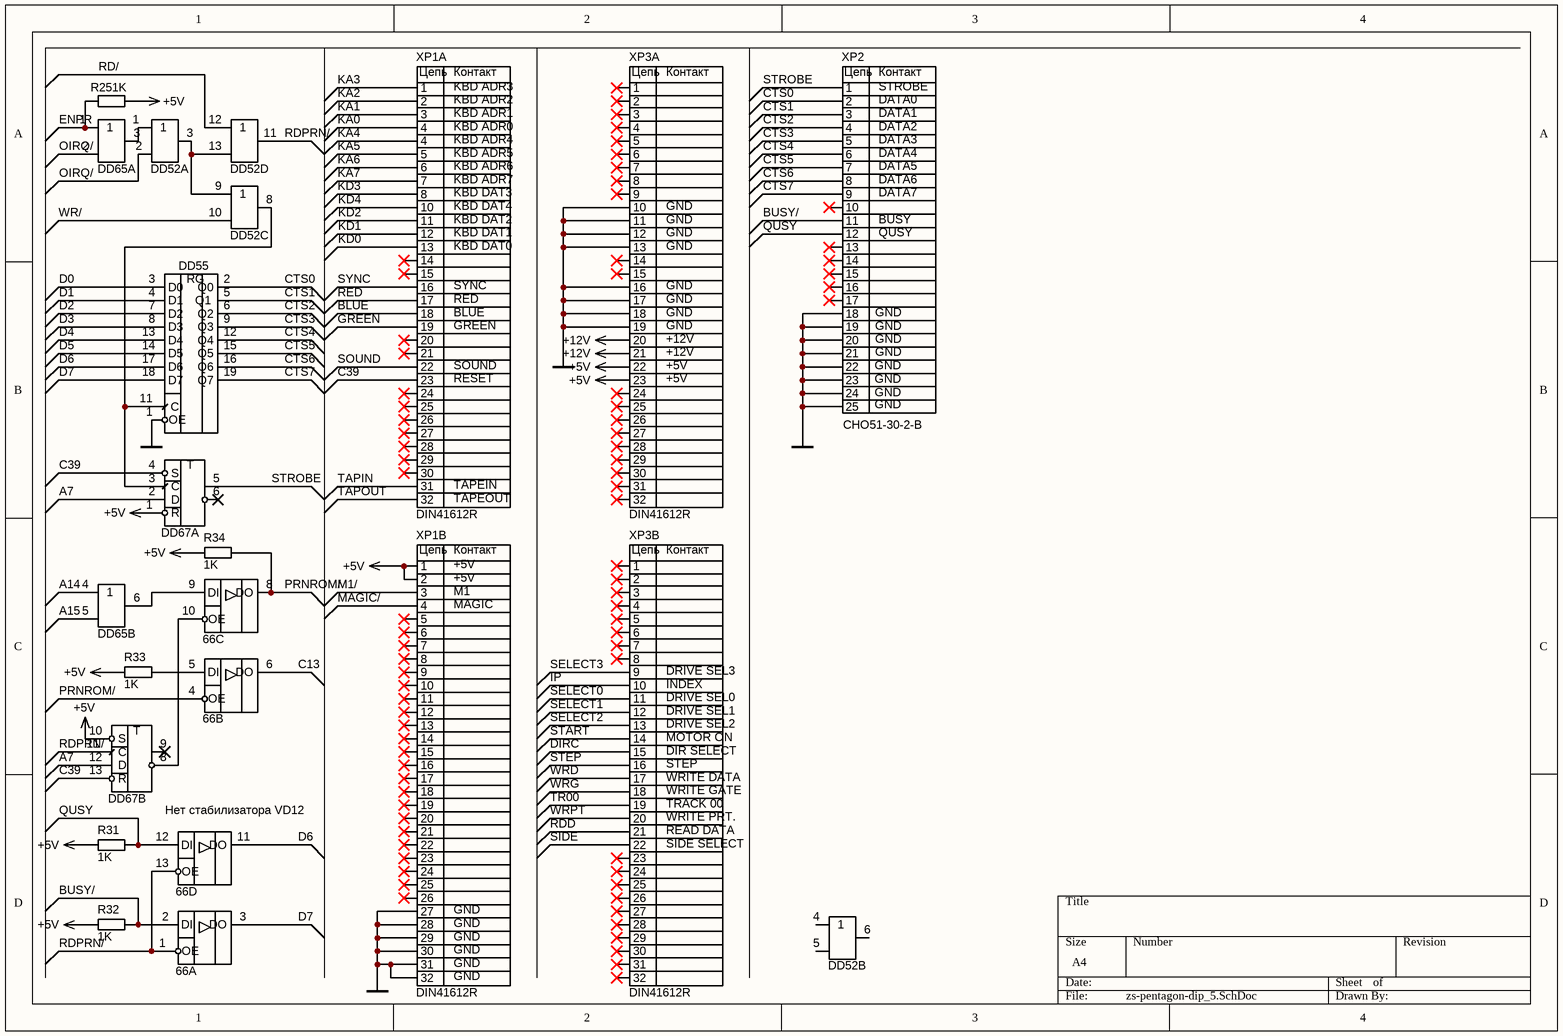
[diagram p4: zs-pentagon-dip_5.SchDoc]

### Parts
66  КР1533ЛП8  [DIP14]  (value not drawn)  (parts A,B,C,D of 4)
DD52  КР1533ЛЛ1  [DIP14]  (value not drawn)  (parts A,B,C,D of 4)
DD55  КР1533ИР23  [DIP20]  (value not drawn)
DD65  КР1533ЛЛ1  [DIP14]  (value not drawn)  (parts A,B of 4)
DD67  КР1533ТМ2  [DIP14]  (value not drawn)  (parts A,B of 2)
R25  1K  [R0603]
R31  1K  [R0603]
R32  1K  [R0603]
R33  1K  [R0603]
R34  1K  [R0603]
XP1  DIN41612R  [TE_6-1393644-3]  (parts A,B of 2)
XP2  СНО51-30-2-В
XP3  DIN41612R  [TE_6-1393644-3]  (parts A,B of 2)

### Nets
+5V: DD67.1(R) DD67.10(S) R25.1 R31.1 R32.1 R33.1 R34.1 XP1.33(1) XP1.34(2) XP3.22 XP3.23  [project net VCC]
+12V: XP3.20 XP3.21
GND: DD55.1(OE) XP1.59(27) XP1.60(28) XP1.61(29) XP1.62(30) XP1.63(31) XP1.64(32) XP2.18 XP2.19 XP2.20 XP2.21 XP2.22 XP2.23 XP2.24 XP2.25 XP3.10 XP3.11 XP3.12 XP3.13 XP3.16 XP3.17 XP3.18 XP3.19
A7: DD67.2(D) DD67.12(D)
A14: DD65.4
A15: DD65.5
BLUE: XP1.18
BUSY/: 66.2(DI) R32.2 XP2.11
C13: 66.6(DO)
C39: DD67.4(S) DD67.13(R) XP1.23
CTS0: DD55.2(Q0) XP2.2
CTS1: DD55.5(Q1) XP2.3
CTS2: DD55.6(Q2) XP2.4
CTS3: DD55.9(Q3) XP2.5
CTS4: DD55.12(Q4) XP2.6
CTS5: DD55.15(Q5) XP2.7
CTS6: DD55.16(Q6) XP2.8
CTS7: DD55.19(Q7) XP2.9
D0: DD55.3(D0)
D1: DD55.4(D1)
D2: DD55.7(D2)
D3: DD55.8(D3)
D4: DD55.13(D4)
D5: DD55.14(D5)
D6: 66.11(DO) DD55.17(D6)
D7: 66.3(DO) DD55.18(D7)
DIRC: XP3.47(15)
ENPR: DD65.1 R25.2
GREEN: XP1.19
IP: XP3.42(10)
KA0: XP1.4
KA1: XP1.3
KA2: XP1.2
KA3: XP1.1
KA4: XP1.5(4)
KA5: XP1.6(5)
KA6: XP1.7(6)
KA7: XP1.8(7)
KD0: XP1.13
KD1: XP1.12
KD2: XP1.11
KD3: XP1.9(8)
KD4: XP1.10
M1/: XP1.35(3)
MAGIC/: XP1.36(4)
OIRQ/: DD52.2 DD65.2
PRNROM/: 66.4(OE) 66.8(DO) R34.2
QUSY: 66.12(DI) R31.2 XP2.12
RD/: DD52.12
RDD: XP3.53(21)
RDPRN/: 66.1(OE) 66.13(OE) DD52.11 DD67.11(C)
RED: XP1.17
SELECT0: XP3.43(11)
SELECT1: XP3.44(12)
SELECT2: XP3.45(13)
SELECT3: XP3.41(9)
SIDE: XP3.54(22)
SOUND: XP1.22
START: XP3.46(14)
STEP: XP3.48(16)
STROBE: DD67.5 XP2.1
SYNC: XP1.16
TAPIN: XP1.31
TAPOUT: XP1.32
TR00: XP3.51(19)
WR/: DD52.10
WRD: XP3.49(17)
WRG: XP3.50(18)
WRPT: XP3.52(20)
Net66_5: 66.5(DI) R33.2
Net66_9: 66.9(DI) DD65.6
Net66_10: 66.10(OE) DD67.8
NetDD52_1: DD52.1 DD65.3
NetDD52_3: DD52.3 DD52.9 DD52.13
NetDD52_8: DD52.8 DD55.11(C) DD67.3(C)

Not connected (* = marked no-connect by the designer): 66 7(GND) 14(VCC); DD52 4 5 6 7(GND) 14(VCC); DD55 10(GND) 20(VCC); DD65 7(GND) 14(VCC); DD67 6* 7(GND) 9* 14(VCC); XP1 14* 15* 20* 21* 24* 25* 26* 27* 28* 29* 30* 37(5)* 38(6)* 39(7)* 40(8)* 41(9)* 42(10)* 43(11)* 44(12)* 45(13)* 46(14)* 47(15)* 48(16)* 49(17)* 50(18)* 51(19)* 52(20)* 53(21)* 54(22)* 55(23)* 56(24)* 57(25)* 58(26)*; XP2 10* 13* 14* 15* 16* 17*; XP3 1* 2* 3* 4* 5* 6* 7* 8* 9* 14* 15* 24* 25* 26* 27* 28* 29* 30* 31* 32* 33(1)* 34(2)* 35(3)* 36(4)* 37(5)* 38(6)* 39(7)* 40(8)* 55(23)* 56(24)* 57(25)* 58(26)* 59(27)* 60(28)* 61(29)* 62(30)* 63(31)* 64(32)*

### Notes on the sheet
- Нет стабилизатора VD12
- (in symbol DIN41612R Pent, part A) Цепь; Контакт; KBD ADR3; KBD ADR2; KBD ADR1; KBD ADR0; KBD ADR4; KBD ADR5; KBD ADR6; KBD ADR7; KBD DAT3; KBD DAT4; KBD DAT2; KBD DAT1; KBD DAT0; SYNC; RED; BLUE; GREEN; SOUND; RESET; TAPEIN; TAPEOUT
- (in symbol DIN41612R Pent, part B) Цепь; Контакт; +5V; M1; MAGIC; GND
- (in symbol DIN41612R Pent XP2, part A) Цепь; Контакт; GND; +12V; +5V
- (in symbol DIN41612R Pent XP2, part B) Цепь; Контакт; DRIVE SEL3; INDEX; DRIVE SEL0; DRIVE SEL1; DRIVE SEL2; MOTOR ON; DIR SELECT; STEP; WRITE DATA; WRITE GATE; TRACK 00; WRITE PRT.; READ DATA; SIDE SELECT
- (in symbol КР1533ИР23) RG
- (in symbol КР1533ТМ2, part A) Т
- (in symbol КР1533ТМ2, part B) Т
- (in symbol СНО51-30-2-В) Цепь; Контакт; STROBE; DATA0; DATA1; DATA2; DATA3; DATA4; DATA5; DATA6; DATA7; BUSY; QUSY; GND

### Library data of the parts
R25 R31-R34 = Res
XP1 = DIN41612R Pent: zx-pentagon XP1
XP3 = DIN41612R Pent XP2: zx-pentagon XP2

## Nets that join several sheets
+12V: zs-pentagon-dip_4 (VD101.A), zs-pentagon-dip_5 (XP3.20 XP3.21)
GND: zs-pentagon-dip_1 (37 pins), zs-pentagon-dip_2 (12 pins), zs-pentagon-dip_3 (24 pins), zs-pentagon-dip_4 (25 pins), zs-pentagon-dip_5 (23 pins)
VCC: zs-pentagon-dip_1 (33 pins), zs-pentagon-dip_2 (22 pins), zs-pentagon-dip_3 (30 pins), zs-pentagon-dip_4 (43 pins), zs-pentagon-dip_5 (11 pins)
A0: zs-pentagon-dip_2 (DD13.30 DD18.3 DD36.10 DD54.8), zs-pentagon-dip_3 (DD50.8), zs-pentagon-dip_4 (DD82.1)
A1: zs-pentagon-dip_1 (DD64.5), zs-pentagon-dip_2 (DD13.31 DD18.6 DD36.9 DD54.7), zs-pentagon-dip_4 (DD82.2)
A5: zs-pentagon-dip_2 (DD13.35 DD19.6 DD36.5 DD54.3), zs-pentagon-dip_4 (DD90.5)
A6: zs-pentagon-dip_2 (DD13.36 DD19.10 DD36.4 DD54.2), zs-pentagon-dip_4 (DD90.6)
A7: zs-pentagon-dip_2 (DD13.37 DD18.2 DD36.3 DD54.1), zs-pentagon-dip_4 (DD89.3), zs-pentagon-dip_5 (DD67.2 DD67.12)
A8: zs-pentagon-dip_2 (DD13.38 DD18.5 DD36.25 DD54.23), zs-pentagon-dip_3 (DD70.2), zs-pentagon-dip_4 (DD75.1)
A9: zs-pentagon-dip_2 (DD13.39 DD18.11 DD36.24 DD54.22), zs-pentagon-dip_3 (DD70.4), zs-pentagon-dip_4 (DD84.9)
A10: zs-pentagon-dip_2 (DD13.40 DD18.14 DD36.21 DD54.19), zs-pentagon-dip_3 (DD70.6), zs-pentagon-dip_4 (DD75.2)
A11: zs-pentagon-dip_2 (DD13.1 DD19.2 DD36.23), zs-pentagon-dip_3 (DD70.8), zs-pentagon-dip_4 (DD75.3)
A12: zs-pentagon-dip_2 (DD13.2 DD19.5 DD36.2), zs-pentagon-dip_3 (DD70.11), zs-pentagon-dip_4 (DD75.4)
A13: zs-pentagon-dip_2 (DD13.3 DD19.11 DD36.26), zs-pentagon-dip_3 (DD70.13), zs-pentagon-dip_4 (DD75.5)
A14: zs-pentagon-dip_1 (DD50.2 DD61.3 DD61.10 DD63.4), zs-pentagon-dip_2 (DD13.4), zs-pentagon-dip_3 (DD70.15), zs-pentagon-dip_4 (DD77.2), zs-pentagon-dip_5 (DD65.4)
A15: zs-pentagon-dip_1 (DD50.3 DD61.6 DD63.5 DD64.6), zs-pentagon-dip_2 (DD13.5), zs-pentagon-dip_3 (DD70.17), zs-pentagon-dip_4 (DD77.1), zs-pentagon-dip_5 (DD65.5)
B1: zs-pentagon-dip_1 (DD3.6 DD10.11), zs-pentagon-dip_2 (DD16.3)
B2: zs-pentagon-dip_1 (DD3.7), zs-pentagon-dip_2 (DD16.6)
B3: zs-pentagon-dip_1 (DD1.5 DD4.3), zs-pentagon-dip_2 (DD16.10)
B4: zs-pentagon-dip_1 (DD4.2 DD8.8), zs-pentagon-dip_2 (DD16.13)
B5: zs-pentagon-dip_1 (DD4.6 DD9.12), zs-pentagon-dip_2 (DD17.3)
B9: zs-pentagon-dip_1 (DD11.8), zs-pentagon-dip_2 (DD17.6)
B10: zs-pentagon-dip_1 (DD5.9 DD11.11 DD12.14), zs-pentagon-dip_2 (DD17.10)
B11: zs-pentagon-dip_1 (DD5.10 DD12.1 DD12.12), zs-pentagon-dip_2 (DD16.2)
B14: zs-pentagon-dip_1 (DD14.4), zs-pentagon-dip_2 (DD16.5)
B15: zs-pentagon-dip_1 (DD14.7), zs-pentagon-dip_2 (DD16.11)
B16: zs-pentagon-dip_1 (DD14.9), zs-pentagon-dip_2 (DD16.14)
B17: zs-pentagon-dip_1 (DD14.12), zs-pentagon-dip_2 (DD17.2)
B18: zs-pentagon-dip_1 (DD51.8), zs-pentagon-dip_2 (DD17.5)
BL: zs-pentagon-dip_1 (C17.2 R16.2 VT1.1), zs-pentagon-dip_3 (DD46.1 DD46.15 DD47.1 DD47.15)
BLUE: zs-pentagon-dip_3 (R35.1 R40.1), zs-pentagon-dip_5 (XP1.18)
C1: zs-pentagon-dip_1 (DD2.9), zs-pentagon-dip_3 (DD41.9 DD42.9)
C2: zs-pentagon-dip_1 (DD5.6), zs-pentagon-dip_3 (DD41.6 DD42.6)
C3: zs-pentagon-dip_1 (DD1.12), zs-pentagon-dip_3 (DD40.11)
C5: zs-pentagon-dip_1 (DD10.8), zs-pentagon-dip_3 (DD46.2 DD47.2)
C7: zs-pentagon-dip_1 (DD6.3), zs-pentagon-dip_3 (DD71.13)
C8: zs-pentagon-dip_1 (C7.1 DD51.10), zs-pentagon-dip_2 (DD13.16)
C13: zs-pentagon-dip_1 (R23.1), zs-pentagon-dip_2 (DD85.2), zs-pentagon-dip_5 (66.6)
C16: zs-pentagon-dip_1 (DD51.4), zs-pentagon-dip_2 (16 pins)
C17: zs-pentagon-dip_1 (DD7.6), zs-pentagon-dip_3 (DD37.11)
C18: zs-pentagon-dip_1 (DD7.3), zs-pentagon-dip_3 (DD38.11)
C19: zs-pentagon-dip_1 (DD49.6), zs-pentagon-dip_2 (DD39.1)
C20: zs-pentagon-dip_1 (DD49.11 DD50.6), zs-pentagon-dip_2 (DD39.11)
C25: zs-pentagon-dip_1 (DD1.8 DD5.3 DD45.4), zs-pentagon-dip_2 (DD13.6 R21.2)
C33: zs-pentagon-dip_1 (DD61.4), zs-pentagon-dip_2 (DD19.14)
C34: zs-pentagon-dip_1 (DD61.7), zs-pentagon-dip_2 (DD19.13)
C35: zs-pentagon-dip_1 (DD62.10), zs-pentagon-dip_2 (DD17.13)
C36: zs-pentagon-dip_1 (DD62.12), zs-pentagon-dip_4 (DD75.11 DD83.10)
C37: zs-pentagon-dip_1 (DD63.11), zs-pentagon-dip_2 (8 pins)
C38: zs-pentagon-dip_1 (DD63.3), zs-pentagon-dip_2 (8 pins)
C39: zs-pentagon-dip_1 (DD62.1), zs-pentagon-dip_2 (C8.2 DD13.26 R18.2), zs-pentagon-dip_4 (DD82.4), zs-pentagon-dip_5 (DD67.4 DD67.13 XP1.23)
CPU: zs-pentagon-dip_1 (DD15.5 DD49.12), zs-pentagon-dip_2 (DD16.15 DD17.15)
D0: zs-pentagon-dip_1 (DD62.3), zs-pentagon-dip_2 (7 pins), zs-pentagon-dip_3 (DD43.4 DD44.3), zs-pentagon-dip_4 (DD88.14 DD90.7), zs-pentagon-dip_5 (DD55.3)
D1: zs-pentagon-dip_1 (DD62.4), zs-pentagon-dip_2 (7 pins), zs-pentagon-dip_3 (DD43.5 DD44.5), zs-pentagon-dip_4 (DD88.13 DD90.8), zs-pentagon-dip_5 (DD55.4)
D2: zs-pentagon-dip_1 (DD62.6), zs-pentagon-dip_2 (7 pins), zs-pentagon-dip_3 (DD43.12 DD44.7), zs-pentagon-dip_4 (DD88.11 DD90.9), zs-pentagon-dip_5 (DD55.7)
D3: zs-pentagon-dip_1 (DD62.11), zs-pentagon-dip_2 (7 pins), zs-pentagon-dip_3 (DD43.13 DD44.9), zs-pentagon-dip_4 (DD88.6 DD90.10), zs-pentagon-dip_5 (DD55.8)
D4: zs-pentagon-dip_1 (DD62.13), zs-pentagon-dip_2 (7 pins), zs-pentagon-dip_3 (DD10.2 DD44.12), zs-pentagon-dip_4 (DD88.4 DD90.11), zs-pentagon-dip_5 (DD55.13)
D5: zs-pentagon-dip_1 (DD62.14), zs-pentagon-dip_2 (7 pins), zs-pentagon-dip_3 (DD44.14), zs-pentagon-dip_4 (DD90.12), zs-pentagon-dip_5 (DD55.14)
D6: zs-pentagon-dip_2 (7 pins), zs-pentagon-dip_3 (DD44.16), zs-pentagon-dip_4 (DD88.3 DD90.13 DD91.13), zs-pentagon-dip_5 (66.11 DD55.17)
D7: zs-pentagon-dip_2 (7 pins), zs-pentagon-dip_3 (DD44.18), zs-pentagon-dip_4 (DD90.14 DD91.11), zs-pentagon-dip_5 (66.3 DD55.18)
DIRC: zs-pentagon-dip_4 (DD94.8), zs-pentagon-dip_5 (XP3.47)
DIS: zs-pentagon-dip_1 (5 pins), zs-pentagon-dip_2 (DD18.15 DD19.15)
DOSEN/: zs-pentagon-dip_2 (DD36.1), zs-pentagon-dip_4 (DD83.11 DD84.5)
GREEN: zs-pentagon-dip_3 (R37.1 R38.1), zs-pentagon-dip_5 (XP1.19)
IORQ/: zs-pentagon-dip_1 (DD64.8), zs-pentagon-dip_2 (DD13.20), zs-pentagon-dip_3 (DD50.9), zs-pentagon-dip_4 (DD83.1 DD85.5)
IP: zs-pentagon-dip_4 (R7.2), zs-pentagon-dip_5 (XP3.42)
KA0: zs-pentagon-dip_3 (VD4.A), zs-pentagon-dip_5 (XP1.4)
KA1: zs-pentagon-dip_3 (VD5.A), zs-pentagon-dip_5 (XP1.3)
KA2: zs-pentagon-dip_3 (VD6.A), zs-pentagon-dip_5 (XP1.2)
KA3: zs-pentagon-dip_3 (VD7.A), zs-pentagon-dip_5 (XP1.1)
KA4: zs-pentagon-dip_3 (VD8.A), zs-pentagon-dip_5 (XP1.5)
KA5: zs-pentagon-dip_3 (VD9.A), zs-pentagon-dip_5 (XP1.6)
KA6: zs-pentagon-dip_3 (VD10.A), zs-pentagon-dip_5 (XP1.7)
KA7: zs-pentagon-dip_3 (VD11.A), zs-pentagon-dip_5 (XP1.8)
KD0: zs-pentagon-dip_3 (DD44.17 R26.1), zs-pentagon-dip_5 (XP1.13)
KD1: zs-pentagon-dip_3 (DD44.15 R27.1), zs-pentagon-dip_5 (XP1.12)
KD2: zs-pentagon-dip_3 (DD44.13 R28.1), zs-pentagon-dip_5 (XP1.11)
KD3: zs-pentagon-dip_3 (DD44.11 R29.1), zs-pentagon-dip_5 (XP1.9)
KD4: zs-pentagon-dip_3 (DD44.8 R30.1), zs-pentagon-dip_5 (XP1.10)
M1/: zs-pentagon-dip_2 (DD13.27), zs-pentagon-dip_4 (DD77.5), zs-pentagon-dip_5 (XP1.35)
MAGIC/: zs-pentagon-dip_4 (DD78.1 R10.2), zs-pentagon-dip_5 (XP1.36)
MREQ/: zs-pentagon-dip_1 (DD50.12), zs-pentagon-dip_2 (DD13.19 DD54.20 DD85.1), zs-pentagon-dip_4 (DD77.4)
NMI/: zs-pentagon-dip_2 (DD13.17 R22.2), zs-pentagon-dip_4 (DD78.4)
OIRQ/: zs-pentagon-dip_4 (DD85.6), zs-pentagon-dip_5 (DD52.2 DD65.2)
PRNROM/: zs-pentagon-dip_2 (DD54.18), zs-pentagon-dip_5 (66.4 66.8 R34.2)
Q0: zs-pentagon-dip_2 (17 pins), zs-pentagon-dip_3 (DD37.3 DD38.3)
Q1: zs-pentagon-dip_2 (DD39.4), zs-pentagon-dip_3 (DD37.4 DD38.4)
Q2: zs-pentagon-dip_2 (DD39.7), zs-pentagon-dip_3 (DD37.7 DD38.7)
Q3: zs-pentagon-dip_2 (DD39.8), zs-pentagon-dip_3 (DD37.8 DD38.8)
Q4: zs-pentagon-dip_2 (DD39.13), zs-pentagon-dip_3 (DD37.13 DD38.13)
Q5: zs-pentagon-dip_2 (DD39.14), zs-pentagon-dip_3 (DD37.14 DD38.14)
Q6: zs-pentagon-dip_2 (DD39.17), zs-pentagon-dip_3 (DD37.17 DD38.17)
Q7: zs-pentagon-dip_2 (DD39.18), zs-pentagon-dip_3 (DD37.18 DD38.18)
RAS/: zs-pentagon-dip_1 (DD45.3), zs-pentagon-dip_2 (21 pins)
RD: zs-pentagon-dip_1 (DD1.10 DD49.5), zs-pentagon-dip_3 (DD49.1)
RD/: zs-pentagon-dip_1 (DD1.11 DD49.10), zs-pentagon-dip_2 (DD13.21), zs-pentagon-dip_4 (DD90.4), zs-pentagon-dip_5 (DD52.12)
RDD: zs-pentagon-dip_4 (DD92.2 R3.2), zs-pentagon-dip_5 (XP3.53)
RED: zs-pentagon-dip_3 (R36.1 R39.1), zs-pentagon-dip_5 (XP1.17)
RFS/: zs-pentagon-dip_1 (DD5.2), zs-pentagon-dip_2 (DD13.28)
ROM2: zs-pentagon-dip_2 (DD36.27), zs-pentagon-dip_4 (DD83.8)
SELECT0: zs-pentagon-dip_4 (DD95.10), zs-pentagon-dip_5 (XP3.43)
SELECT1: zs-pentagon-dip_4 (DD95.8), zs-pentagon-dip_5 (XP3.44)
SELECT2: zs-pentagon-dip_4 (DD95.6), zs-pentagon-dip_5 (XP3.45)
SELECT3: zs-pentagon-dip_4 (DD95.4), zs-pentagon-dip_5 (XP3.41)
SIDE: zs-pentagon-dip_4 (DD95.2), zs-pentagon-dip_5 (XP3.54)
SOUND: zs-pentagon-dip_3 (DD10.5 R44.2), zs-pentagon-dip_5 (XP1.22)
START: zs-pentagon-dip_4 (DD94.10), zs-pentagon-dip_5 (XP3.46)
STEP: zs-pentagon-dip_4 (DD94.6), zs-pentagon-dip_5 (XP3.48)
SYNC: zs-pentagon-dip_3 (DD72.11), zs-pentagon-dip_5 (XP1.16)
TAPIN: zs-pentagon-dip_3 (C12.1), zs-pentagon-dip_5 (XP1.31)
TAPOUT: zs-pentagon-dip_3 (R43.1), zs-pentagon-dip_5 (XP1.32)
TR00: zs-pentagon-dip_4 (DD91.4 R8.2), zs-pentagon-dip_5 (XP3.51)
WR/: zs-pentagon-dip_1 (DD64.9), zs-pentagon-dip_2 (DD13.22), zs-pentagon-dip_3 (DD8.6), zs-pentagon-dip_4 (DD89.13 DD90.2), zs-pentagon-dip_5 (DD52.10)
WRD: zs-pentagon-dip_4 (DD94.2), zs-pentagon-dip_5 (XP3.49)
WRG: zs-pentagon-dip_4 (DD94.4), zs-pentagon-dip_5 (XP3.50)
WRPT: zs-pentagon-dip_4 (DD91.6 R9.2), zs-pentagon-dip_5 (XP3.52)